# Altium schematic sheet IO_Connector_Dual_HDR5x1.SchDoc: IO Connector Dual HDR5x1
size A4
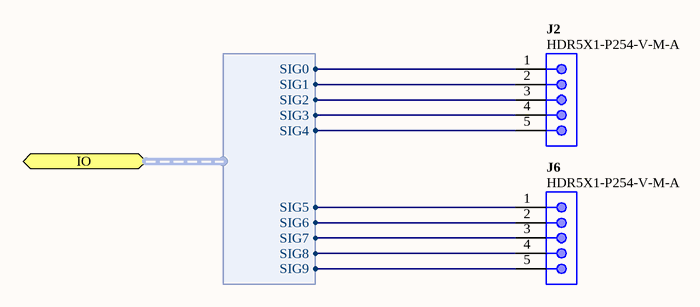
[diagram p0: IO_Connector_Dual_HDR5x1.SchDoc]

## Parts
J2  HDR5X1-P254-V-M-A  [HDR5X1-P254-V-M-A]
J6  HDR5X1-P254-V-M-A  [HDR5X1-P254-V-M-A]

## Ports
IO (harness SIG10)

## Harnesses
SIG10: SIG0, SIG1, SIG2, SIG3, SIG4, SIG5, SIG6, SIG7, SIG8, SIG9

## Nets
NetJ2_1: J2.1 ; port IO.SIG0
NetJ2_2: J2.2 ; port IO.SIG1
NetJ2_3: J2.3 ; port IO.SIG2
NetJ2_4: J2.4 ; port IO.SIG3
NetJ2_5: J2.5 ; port IO.SIG4
NetJ6_1: J6.1 ; port IO.SIG5
NetJ6_2: J6.2 ; port IO.SIG6
NetJ6_3: J6.3 ; port IO.SIG7
NetJ6_4: J6.4 ; port IO.SIG8
NetJ6_5: J6.5 ; port IO.SIG9

## Notes on the sheet
- Sheet Title
- Project Title
- Size:
- Date:
- A4
- Item:
- Time:
- Revision:
- Sheet
- of
- File:

## Library data of the parts
J2 J6 = CMP-5167-00036-1: Male Header IDC, 1 x 5 Pin Vertical 2.54mm Pitch, 5.84mm Mated Height; Class: Board Connector; Component Kind: Standard